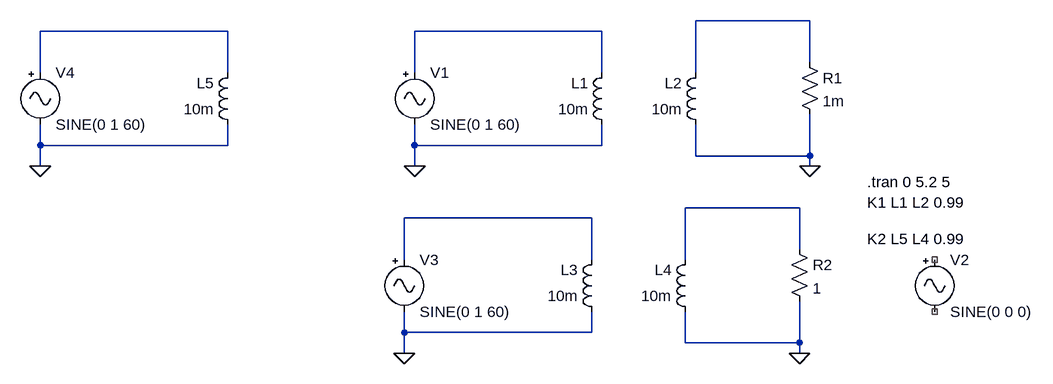
[diagram p0: schematic Transformer_Test.asc]
Transformer_Test.asc, the LTspice schematic file:
Version 4.1
SHEET 1 1124 724
WIRE 656 64 480 64
WIRE -240 80 -528 80
WIRE 336 80 48 80
WIRE 656 128 656 64
WIRE -528 144 -528 80
WIRE -240 144 -240 80
WIRE 48 144 48 80
WIRE 336 144 336 80
WIRE 480 144 480 64
WIRE -528 256 -528 224
WIRE -240 256 -240 224
WIRE -240 256 -528 256
WIRE 48 256 48 224
WIRE 336 256 336 224
WIRE 336 256 48 256
WIRE 480 272 480 224
WIRE 656 272 656 208
WIRE 656 272 480 272
WIRE -528 288 -528 256
WIRE 48 288 48 256
WIRE 656 288 656 272
WIRE 640 352 464 352
WIRE 320 368 32 368
WIRE 640 416 640 352
WIRE 32 432 32 368
WIRE 320 432 320 368
WIRE 464 432 464 352
WIRE 32 544 32 512
WIRE 320 544 320 512
WIRE 320 544 32 544
WIRE 464 560 464 512
WIRE 640 560 640 496
WIRE 640 560 464 560
WIRE 32 576 32 544
WIRE 640 576 640 560
FLAG 48 288 0
FLAG 656 288 0
FLAG 32 576 0
FLAG 640 576 0
FLAG -528 288 0
SYMBOL Misc\\signal 48 128 R0
WINDOW 123 0 0 Left 0
WINDOW 39 0 0 Left 0
SYMATTR InstName V1
SYMATTR Value SINE(0 1 60)
SYMBOL ind 352 240 R180
WINDOW 0 36 80 Left 2
WINDOW 3 36 40 Left 2
SYMATTR InstName L1
SYMATTR Value 10m
SYMATTR Type ind
SYMATTR SpiceLine Rser=1m
SYMBOL ind 496 240 R180
WINDOW 0 36 80 Left 2
WINDOW 3 36 40 Left 2
SYMATTR InstName L2
SYMATTR Value 10m
SYMATTR Type ind
SYMATTR SpiceLine Rser=1m
SYMBOL res 640 112 R0
SYMATTR InstName R1
SYMATTR Value 1m
SYMBOL Misc\\signal 848 416 R0
WINDOW 123 0 0 Left 0
WINDOW 39 0 0 Left 0
SYMATTR InstName V2
SYMATTR Value SINE(0 0 0)
SYMBOL Misc\\signal 32 416 R0
WINDOW 123 0 0 Left 0
WINDOW 39 0 0 Left 0
SYMATTR InstName V3
SYMATTR Value SINE(0 1 60)
SYMBOL ind 336 528 R180
WINDOW 0 36 80 Left 2
WINDOW 3 36 40 Left 2
SYMATTR InstName L3
SYMATTR Value 10m
SYMATTR SpiceLine Rser=1m
SYMBOL ind 480 528 R180
WINDOW 0 36 80 Left 2
WINDOW 3 36 40 Left 2
SYMATTR InstName L4
SYMATTR Value 10m
SYMATTR Type ind
SYMATTR SpiceLine Rser=1m
SYMBOL res 624 400 R0
SYMATTR InstName R2
SYMATTR Value 1
SYMBOL Misc\\signal -528 128 R0
WINDOW 123 0 0 Left 0
WINDOW 39 0 0 Left 0
SYMATTR InstName V4
SYMATTR Value SINE(0 1 60)
SYMBOL ind -224 240 R180
WINDOW 0 36 80 Left 2
WINDOW 3 36 40 Left 2
SYMATTR InstName L5
SYMATTR Value 10m
SYMATTR Type ind
SYMATTR SpiceLine Rser=1m
TEXT 744 344 Left 2 !K1 L1 L2 0.99
TEXT 744 312 Left 2 !.tran 0 5.2 5
TEXT 744 400 Left 2 !K2 L5 L4 0.99

The netlist it stands for:
* Transformer_Test.asc
V1 N003 0 SINE(0 1 60)
L1 0 N003 10m Rser=1m
L2 0 N001 10m Rser=1m
R1 N001 0 1m
V2 NC_01 NC_02 SINE(0 0 0)
V3 N005 0 SINE(0 1 60)
L3 0 N005 10m Rser=1m
L4 0 N004 10m Rser=1m
R2 N004 0 1
V4 N002 0 SINE(0 1 60)
L5 0 N002 10m Rser=1m
K1 L1 L2 0.99
.tran 0 5.2 5
K2 L5 L4 0.99
.backanno
.end